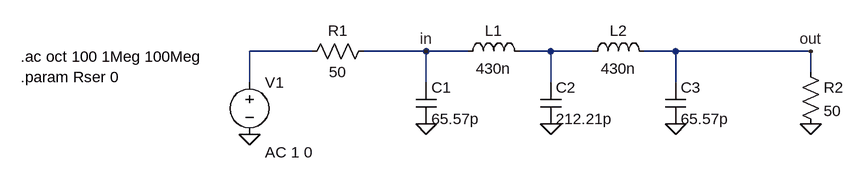
[diagram p0: schematic lpf.asc]
lpf.asc, the LTspice schematic file:
Version 4
SHEET 1 880 680
WIRE -112 144 -208 144
WIRE 64 144 -32 144
WIRE 128 144 64 144
WIRE 256 144 208 144
WIRE 320 144 256 144
WIRE 448 144 400 144
WIRE 656 144 448 144
WIRE 656 176 656 144
WIRE -208 192 -208 144
WIRE 64 192 64 144
WIRE 256 192 256 144
WIRE 448 192 448 144
FLAG 64 256 0
FLAG 256 256 0
FLAG 448 256 0
FLAG 656 256 0
FLAG -208 272 0
FLAG 656 144 out
FLAG 64 144 in
SYMBOL voltage -208 176 R0
WINDOW 123 24 124 Left 2
WINDOW 39 0 0 Left 2
SYMATTR Value2 AC 1 0
SYMATTR InstName V1
SYMATTR Value ""
SYMBOL cap 48 192 R0
SYMATTR InstName C1
SYMATTR Value 65.57p
SYMBOL cap 240 192 R0
SYMATTR InstName C2
SYMATTR Value 212.21p
SYMBOL cap 432 192 R0
SYMATTR InstName C3
SYMATTR Value 65.57p
SYMBOL res 640 160 R0
SYMATTR InstName R2
SYMATTR Value 50
SYMBOL ind 112 160 R270
WINDOW 0 32 56 VTop 2
WINDOW 3 5 56 VBottom 2
SYMATTR InstName L1
SYMATTR Value 430n
SYMATTR SpiceLine Rser=10
SYMBOL ind 304 160 R270
WINDOW 0 32 56 VTop 2
WINDOW 3 5 56 VBottom 2
SYMATTR InstName L2
SYMATTR Value 430n
SYMATTR SpiceLine Rser=10
SYMBOL res -16 128 R90
WINDOW 0 0 56 VBottom 2
WINDOW 3 32 56 VTop 2
SYMATTR InstName R1
SYMATTR Value 50
TEXT -560 152 Left 2 !.ac oct 100 1Meg 100Meg
TEXT -560 184 Left 2 !.param Rser 0

The netlist it stands for:
* lpf.asc
V1 N001 0 AC 1 0
C1 in 0 65.57p
C2 N002 0 212.21p
C3 out 0 65.57p
R2 out 0 50
L1 in N002 430n Rser=10
L2 N002 out 430n Rser=10
R1 in N001 50
.ac oct 100 1Meg 100Meg
.param Rser 0
.backanno
.end

* Results of the author's LTspice run, read from the files saved beside the schematic
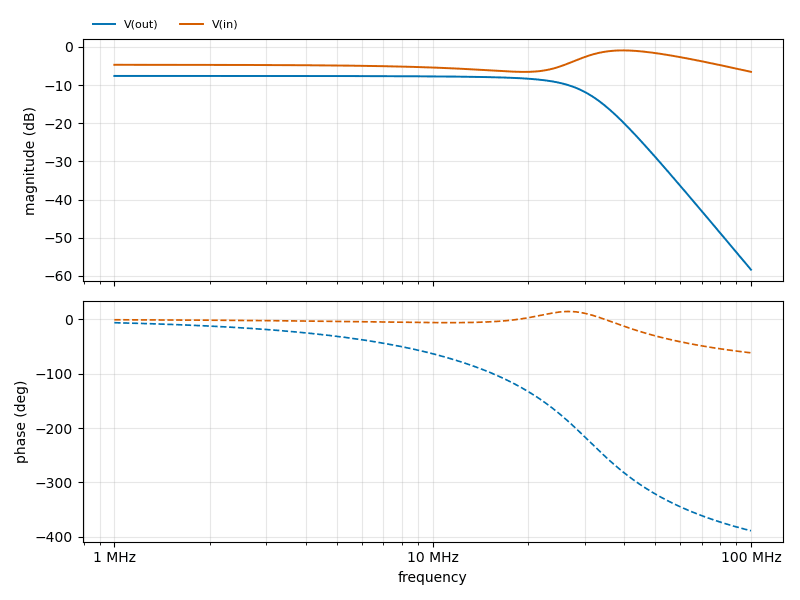
[diagram p1: AC Analysis of lpf.asc, plotted from the saved traces]
* AC Analysis, 1 run:
*   V(out): -7.61 dB at 1 MHz, -58.39 dB at 100 MHz, peak -7.61 dB at 1 MHz, 3 dB below the peak at 27.96 MHz
*   V(in): -4.69 dB at 1 MHz, -6.54 dB at 100 MHz, peak -0.92 dB at 39.67 MHz, 3 dB below the peak at 27.43 MHz and 71.56 MHz